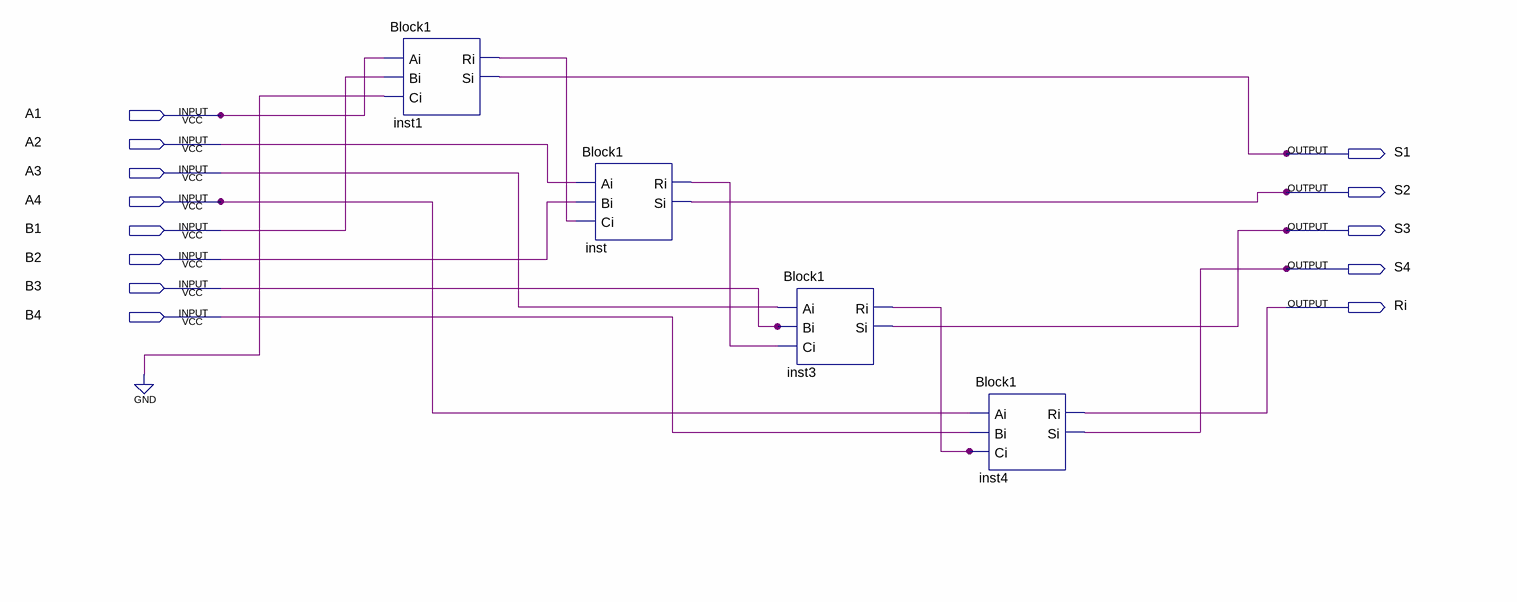
[diagram p0: schematic sheet]
// Quartus schematic Block2.bdf as structural Verilog: 4 symbols, 13 pins
module Block2 (
  input  A1,
  input  A2,
  input  A3,
  input  A4,
  input  B1,
  input  B2,
  input  B3,
  input  B4,
  output S1,
  output S2,
  output S3,
  output S4,
  output Ri
);

  wire inst1_ri, inst3_ri, inst_ri;

  Block1 inst1 (.Ai(A1), .Bi(B1), .Ci(1'b0), .Ri(inst1_ri), .Si(S1));
  Block1 inst (.Ai(A2), .Bi(B2), .Ci(inst1_ri), .Ri(inst_ri), .Si(S2));
  Block1 inst3 (.Ai(A3), .Bi(B3), .Ci(inst_ri), .Ri(inst3_ri), .Si(S3));
  Block1 inst4 (.Ai(A4), .Bi(B4), .Ci(inst3_ri), .Ri(Ri), .Si(S4));
endmodule
